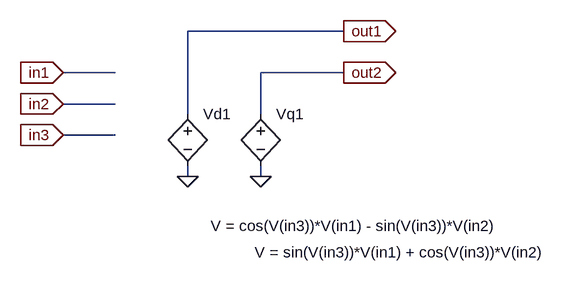
[diagram p0: schematic Rev_Park.asc]
Rev_Park.asc, the LTspice schematic file:
Version 4
SHEET 1 880 680
WIRE 224 -32 -16 -32
WIRE -128 32 -208 32
WIRE 224 32 96 32
WIRE -128 80 -208 80
WIRE -16 96 -16 -32
WIRE 96 96 96 32
WIRE -128 128 -208 128
WIRE -16 192 -16 176
WIRE 96 192 96 176
FLAG -208 32 in1
IOPIN -208 32 In
FLAG -208 80 in2
IOPIN -208 80 In
FLAG -208 128 in3
IOPIN -208 128 In
FLAG -16 192 0
FLAG 96 192 0
FLAG 224 -32 out1
IOPIN 224 -32 Out
FLAG 224 32 out2
IOPIN 224 32 Out
SYMBOL bv -16 80 R0
WINDOW 3 35 188 Left 0
SYMATTR Value V = cos(V(in3))*V(in1) - sin(V(in3))*V(in2)
SYMATTR InstName Vd1
SYMBOL bv 96 80 R0
WINDOW 3 -9 229 Left 0
SYMATTR Value V = sin(V(in3))*V(in1) + cos(V(in3))*V(in2)
SYMATTR InstName Vq1

The netlist it stands for:
* Rev_Park.asc
B§Vd1 out1 0 V = cos(V(in3))*V(in1) - sin(V(in3))*V(in2)
B§Vq1 out2 0 V = sin(V(in3))*V(in1) + cos(V(in3))*V(in2)
.backanno
.end